# Altium schematic sheet STLinkMiniOnboard.SchDoc
size B
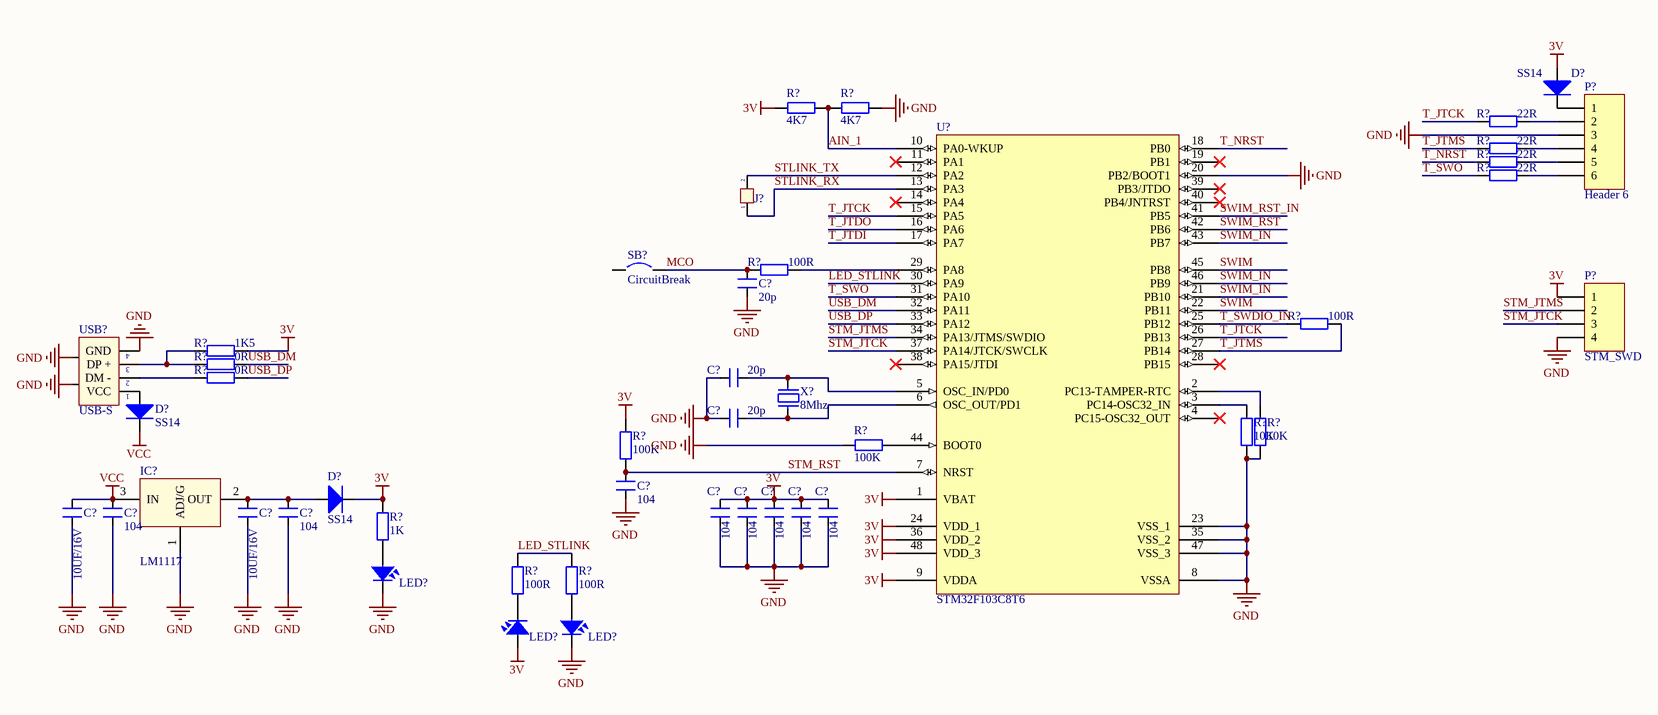
[diagram p0: STLinkMiniOnboard.SchDoc]

## Parts
(Parts that share a designator on the sheet are numbered #1, #2 ... from top to bottom, then left to right.)
C?#1  20p  [0603-CAP]
C?#2  20p  [0603-CAP]
C?#3  20p  [0603-CAP]
C?#4  104  [0603-CAP]
C?#5  10UF/16V  [0603-CAP]
C?#6  104  [0603-CAP]
C?#7  10UF/16V  [0603-CAP]
C?#8  104  [0603-CAP]
C?#9  104  [0603-CAP]
C?#10  104  [0603-CAP]
C?#11  104  [0603-CAP]
C?#12  104  [0603-CAP]
C?#13  104  [0603-CAP]
D?#1  SS14  [DO214AC(SMA)]
D?#2  SS14  [DO214AC(SMA)]
D?#3  SS14  [DO214AC(SMA)]
IC?  LM1117  [SOT223-4N]
J?  Jumper 2  [JP2]  (value not drawn)
LED?#1  LED SMD  [SM-LED-0805-Blue]  (value not drawn)
LED?#2  LED SMD  [SM-LED-0805-Blue]  (value not drawn)
LED?#3  LED SMD  [SM-LED-0805-Blue]  (value not drawn)
P?#1  Header 6  [HDR1X6]
P?#2  STM_SWD  [HDR1X4]
R?#1  4K7  [0603res]
R?#2  4K7  [0603res]
R?#3  22R  [0603res]
R?#4  22R  [0603res]
R?#5  22R  [0603res]
R?#6  22R  [0603res]
R?#7  100R  [0603res]
R?#8  100R  [0603res]
R?#9  1K5  [0603res]
R?#10  0R  [0603res]
R?#11  0R  [0603res]
R?#12  10K  [0603res]
R?#13  10K  [0603res]
R?#14  100K  [0603res]
R?#15  100K  [0603res]
R?#16  1K  [0603res]
R?#17  100R  [0603res]
R?#18  100R  [0603res]
SB?  CircuitBreak  [BreakCircuit]
U?  STM32F103C8T6  [LQFP48_N]
USB?  USB-S  [USB_A_SMD]
X?  8Mhz  [XT2]

## Nets
3V: C?#9.2 C?#10.2 C?#11.2 C?#12.2 C?#13.2 D?#1.1(A) D?#3.2(K) LED?#3.1 P?#2.1 R?#1.2 R?#9.2 R?#14.2 R?#16.2 U?.1(VBAT) U?.9(VDDA) U?.24(VDD_1) U?.36(VDD_2) U?.48(VDD_3)
GND: C?#1.2 C?#2.2 C?#3.2 C?#4.1 C?#5.1 C?#6.1 C?#7.1 C?#8.1 C?#9.1 C?#10.1 C?#11.1 C?#12.1 C?#13.1 IC?.1(ADJ/G) LED?#1.2 LED?#2.2 P?#1.3 P?#2.4 R?#2.1 R?#12.1 R?#13.1 R?#15.2 U?.8(VSSA) U?.20(PB2/BOOT1) U?.23(VSS_1) U?.35(VSS_2) U?.47(VSS_3) USB?.4(GND) USB?.5 USB?.6
VCC: C?#5.2 C?#6.2 D?#2.2(K) IC?.3(IN)
AIN_1: R?#1.1 R?#2.2 U?.10(PA0-WKUP)
LED_STLINK: R?#17.2 R?#18.2 U?.30(PA9)
MCO: C?#1.1 R?#7.2 SB?.2
STLINK_RX: J?.1 U?.13(PA3)
STLINK_TX: J?.2 U?.12(PA2)
STM_JTCK: P?#2.3 U?.37(PA14/JTCK/SWCLK)
STM_JTMS: P?#2.2 U?.34(PA13/JTMS/SWDIO)
STM_RST: C?#4.2 R?#14.1 U?.7(NRST)
SWIM: U?.22(PB11) U?.45(PB8)
SWIM_IN: U?.21(PB10) U?.43(PB7) U?.46(PB9)
SWIM_RST: U?.42(PB6)
SWIM_RST_IN: U?.41(PB5)
T_JTCK: R?#3.2 U?.15(PA5) U?.26(PB13)
T_JTDI: U?.17(PA7)
T_JTDO: U?.16(PA6)
T_JTMS: R?#4.2 R?#8.1 U?.27(PB14)
T_NRST: R?#5.2 U?.18(PB0)
T_SWDIO_IN: R?#8.2 U?.25(PB12)
T_SWO: R?#6.2 U?.31(PA10)
USB_DM: R?#10.2 U?.32(PA11)
USB_DP: R?#11.2 U?.33(PA12)
NetC?#2_1: C?#2.1 U?.5(OSC_IN/PD0) X?.2
NetC?#3_1: C?#3.1 U?.6(OSC_OUT/PD1) X?.1
NetC?#7_2: C?#7.2 C?#8.2 D?#3.1(A) IC?.2(OUT)
NetD?#1_2: D?#1.2(K) P?#1.1
NetD?#2_1: D?#2.1(A) USB?.1(VCC)
NetLED?#1_1: LED?#1.1 R?#16.1
NetLED?#2_1: LED?#2.1 R?#18.1
NetLED?#3_2: LED?#3.2 R?#17.1
NetP?#1_2: P?#1.2 R?#3.1
NetP?#1_4: P?#1.4 R?#4.1
NetP?#1_5: P?#1.5 R?#5.1
NetP?#1_6: P?#1.6 R?#6.1
NetR?#7_1: R?#7.1 U?.29(PA8)
NetR?#9_1: R?#9.1 R?#10.1 USB?.3(DP_+)
NetR?#11_1: R?#11.1 USB?.2(DM_-)
NetR?#12_2: R?#12.2 U?.3(PC14-OSC32_IN)
NetR?#13_2: R?#13.2 U?.2(PC13-TAMPER-RTC)
NetR?#15_1: R?#15.1 U?.44(BOOT0)

Not connected (* = marked no-connect by the designer): SB? 1; U? 4(PC15-OSC32_OUT)* 11(PA1)* 14(PA4)* 19(PB1)* 28(PB15)* 38(PA15/JTDI)* 39(PB3/JTDO)* 40(PB4/JNTRST)*

## Library data of the parts
C?#1-C?#13 = CM: Cap SMD; Value: 103
D?#1-D?#3 = SS12/13/14/15/16: Schottky Diode; Value: String
IC? = LM1117: Available in 1.8V, 2.5V, 2.85V, 3.3V, 5V, and  Adjustable Versions; Value: LM317
J? = JP 2: Value: JP 2
LED?#1-LED?#3 = LED-SMD-0805
P?#1 = Header 6: Header, 6-Pin; LatestRevisionDate: 17-Jul-2002; LatestRevisionNote: Re-released for DXP Platform.; Publisher: Altium Limited
P?#2 = Header 4: Header, 4-Pin; LatestRevisionDate: 17-Jul-2002; LatestRevisionNote: Re-released for DXP Platform.; Publisher: Altium Limited
R?#1-R?#15 R?#17 R?#18 = RM: Resistor SMD; Value: 1K
R?#16 = RM: Resistor SMD; Value: 1K
SB? = CircuitBreak: Circuit Break; Value: String; Created by: hoangloc360
U? = STM32F103C8T6: STM32 ARM-based 32-bit MCU with 64 Kbytes Flash, 48-pin LQFP, Industrial Temperature; Published: 30-May-2008; DatasheetVersion: rev6, Mar-2008; PackageVersion: Mar-2008; PackageReference: LQFP48; Publisher: Altium Limited; PackageDescription: 48-Pin Low-Profile Quad Flat Pack, 7 x 7 mm Body, 0.5 mm Pitch (LQFP48); ComponentLink1Description: Manufacturer Link; ComponentLink1URL: www.st.com/stm32; ComponentLink2Description: Datasheet; ComponentLink2URL: http://www.st.com/stonline/products/literature/ds/13587.pdf
USB? = USB_S: USB connector; Value: USB
X? = XT2: Crystal For all Crystal 2pin.; Value: 4Mhz